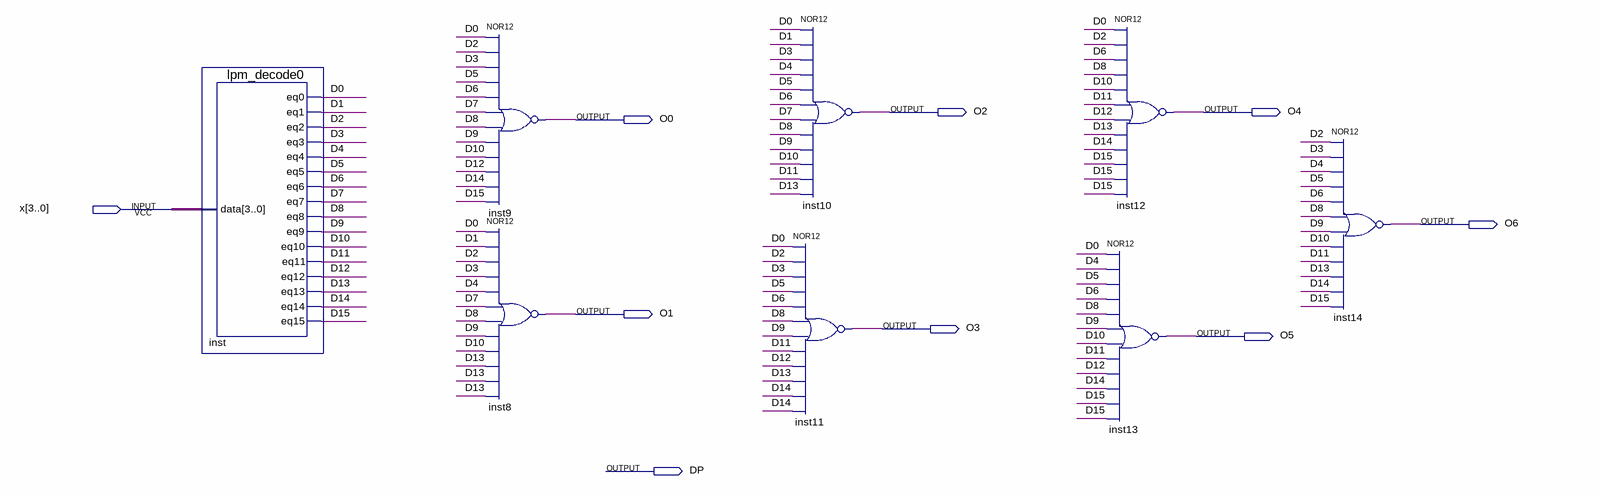
[diagram p0: schematic sheet]
// Quartus schematic Lab22.bdf as structural Verilog: 8 symbols, 9 pins
module Lab22 (
  input  [3:0] x,
  output O2,
  output O4,
  output O0,
  output O6,
  output O1,
  output O3,
  output O5,
  output DP
);

  wire D0, D1, D2, D3, D4, D5, D6, D7, D8, D9, D10, D11, D12, D13, D14, D15;

  lpm_decode0 inst (
    .data(x), .eq0(D0), .eq1(D1), .eq2(D2), .eq3(D3), .eq4(D4), .eq5(D5), .eq6(D6), .eq7(D7), .eq8(D8),
    .eq9(D9), .eq10(D10), .eq11(D11), .eq12(D12), .eq13(D13), .eq14(D14), .eq15(D15));
  nor inst9 (O0, D0, D2, D3, D5, D6, D7, D8, D9, D10, D12, D14, D15);
  nor inst8 (O1, D0, D1, D2, D3, D4, D7, D8, D9, D10, D13, D13, D13);
  nor inst10 (O2, D0, D1, D3, D4, D5, D6, D7, D8, D9, D10, D11, D13);
  nor inst11 (O3, D0, D2, D3, D5, D6, D8, D9, D11, D12, D13, D14, D14);
  nor inst12 (O4, D0, D2, D6, D8, D10, D11, D12, D13, D14, D15, D15, D15);
  nor inst13 (O5, D0, D4, D5, D6, D8, D9, D10, D11, D12, D14, D15, D15);
  nor inst14 (O6, D2, D3, D4, D5, D6, D8, D9, D10, D11, D13, D14, D15);
endmodule
